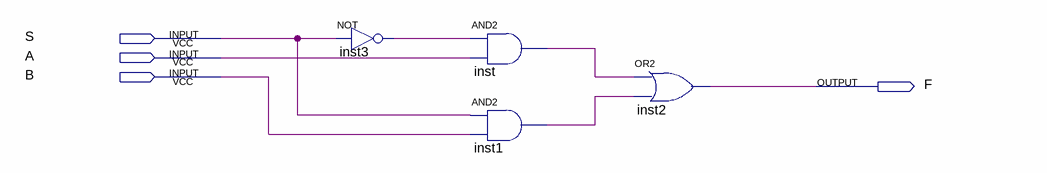
[diagram p0: schematic sheet]
// Quartus schematic MUX2-1.bdf as structural Verilog: 4 symbols, 4 pins
module \MUX2-1  (
  input  S,
  input  A,
  input  B,
  output F
);

  wire inst1_out, inst3_out, inst_out;

  not inst3 (inst3_out, S);
  and inst (inst_out, inst3_out, A);
  and inst1 (inst1_out, S, B);
  or inst2 (F, inst_out, inst1_out);
endmodule
